# EAGLE design nes_breakout (EAGLE 6.5.0)
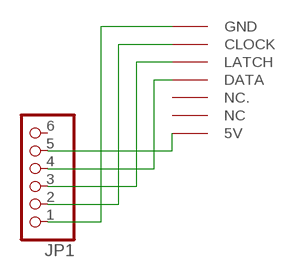
[diagram p0: schematic, sheet 1]

## Parts
JP1  PINHD-1X6  [1X06]
U$2  NESCONNNO_TABS  [NESCONN_NO_TABS]

## Nets
5V: JP1.5 U$2.5V
CLOCK: JP1.2 U$2.CLOCK
DATA: JP1.4 U$2.DATA
GND: JP1.1 U$2.GND
LATCH: JP1.3 U$2.LATCH
Unconnected: JP1.6 U$2.NC U$2.NC.

## Library data of the parts
JP1 = pinhead:PINHD-1X6: PIN HEADER
U$2 = gamepad-conn:NESCONN

## Board
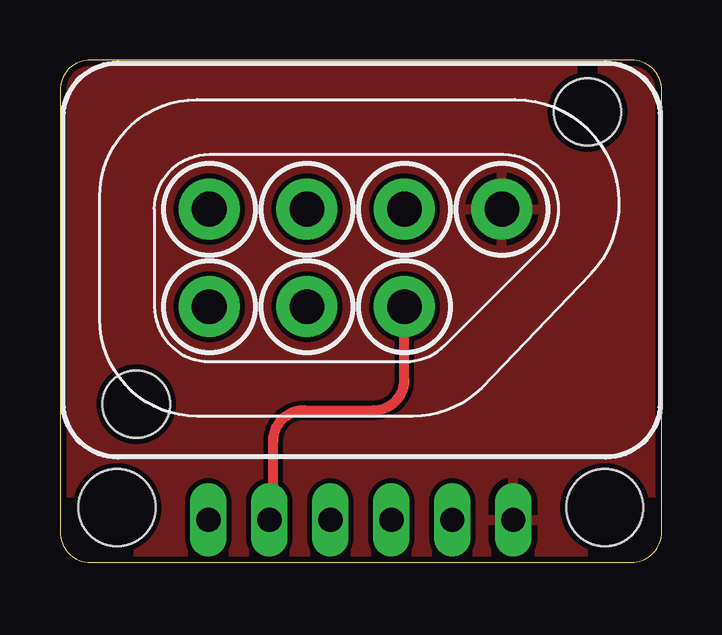
[diagram p1: board, top side]
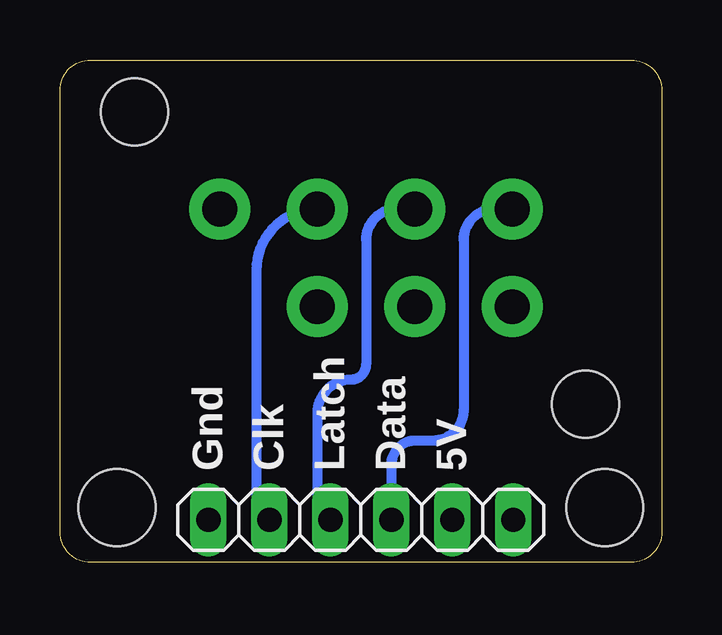
[diagram p2: board, bottom side, seen from below]

Size 25.07 x 20.95 mm. Coordinates in mm from the lower left corner, seen from the top.
Outline: 23.8,20.95 1.27,20.95 arc90 0,19.68 0,1.27 arc90 1.27,0 23.8,0 arc90 25.07,1.27 25.07,19.68 arc90 23.8,20.95
Copper layers (1*16): Top 0.035mm / dielectric 1.5mm / Bottom 0.035mm
Design rules "default *": minimum track width 10mil, minimum drill 24mil, track to track 8mil, track to pad 8mil, pad to pad 8mil, via to via 8mil, smd to smd 8mil, copper to edge 10mil, drill to drill 8mil, minimum pad ring 10mil, minimum via ring 8mil, stop-mask expansion 4mil, vias tented up to drill 0mil, thermal gap 10mil
Holes 3.2 mm at 2.37,2.29 22.69,2.29

### Footprints (pad centres in the part's own frame; a part is rotated, then mirrored left to right if it is on the bottom)
1X06 = drill 1.016 long: 1 -6.35,0; 2 -3.81,0; 3 -1.27,0; 4 1.27,0; 5 3.81,0; 6 6.35,0
NESCONN_NO_TABS = drill 1.448 pad 2.54: 5V 8.128,0; CLOCK 8.128,4.064; DATA 0,4.064; GND 12.192,4.064; LATCH 4.064,4.064; NC 0,0; NC. 4.064,0 | hole 2.8: -3.048,-4.064; 15.748,8.128

### Placement (x,y rotation side)
JP1  12.53,1.78 0 bottom
U$2  6.22,10.67 0 top

### Tracks (layer width: path | path; a pad name or v marks a point on that pad's centre or on a via)
5V
  Top 0.406: JP1.5 arc90 8.89,1.94 8.89,5.08 arc-90 10.16,6.35 13.08,6.35 arc90 14.35,7.62 U$2.5V
CLOCK
  Bottom 0.406: U$2.CLOCK arc-90 16.89,12.19 16.89,1.91 16.51,1.91 JP1.2
DATA
  Bottom 0.406: U$2.DATA 6.99,14.73 arc-90 8.26,13.46 8.26,6.35 arc90 9.53,5.08 10.27,5.08 arc-90 11.27,4.08 JP1.4
GND
  pour Top: 0,0 25.4,0 25.4,21.59 0,21.59
LATCH
  Bottom 0.406: U$2.LATCH 11.05,14.73 arc-90 12.32,13.46 12.32,8.26 arc90 12.95,7.62 arc-90 14.35,6.22 14.35,1.78 JP1.3

### Text on the board
bNames: 5V | Data | Latch | Clk | Gnd